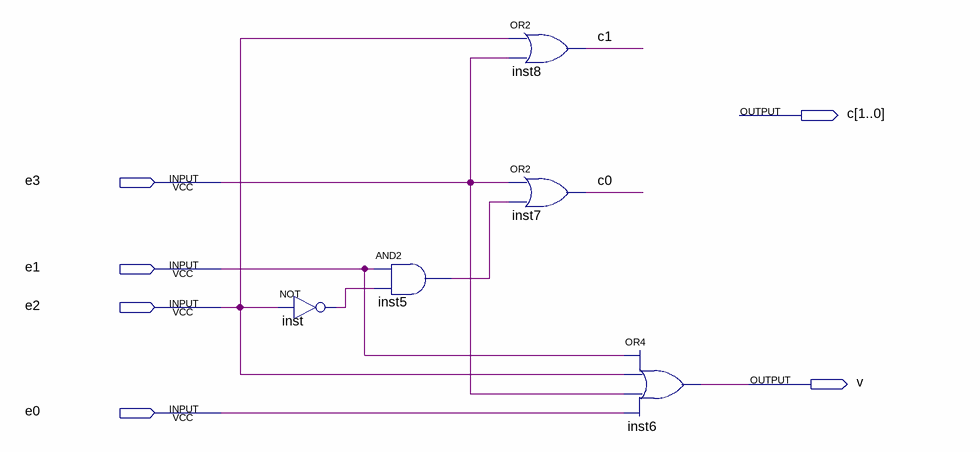
[diagram p0: schematic sheet]
// Quartus schematic cod4x2.bdf as structural Verilog: 5 symbols, 6 pins
module cod4x2 (
  input  e3,
  input  e1,
  input  e2,
  input  e0,
  output [1:0] c,
  output v
);

  wire inst5_out, inst_out;

  not inst (inst_out, e2);
  and inst5 (inst5_out, e1, inst_out);
  or inst8 (c[1], e2, e3);
  or inst7 (c[0], e3, inst5_out);
  or inst6 (v, e1, e2, e3, e0);
endmodule
